# EAGLE design SmartLEDShield_Teensy4_V5 (EAGLE 9.6.1)
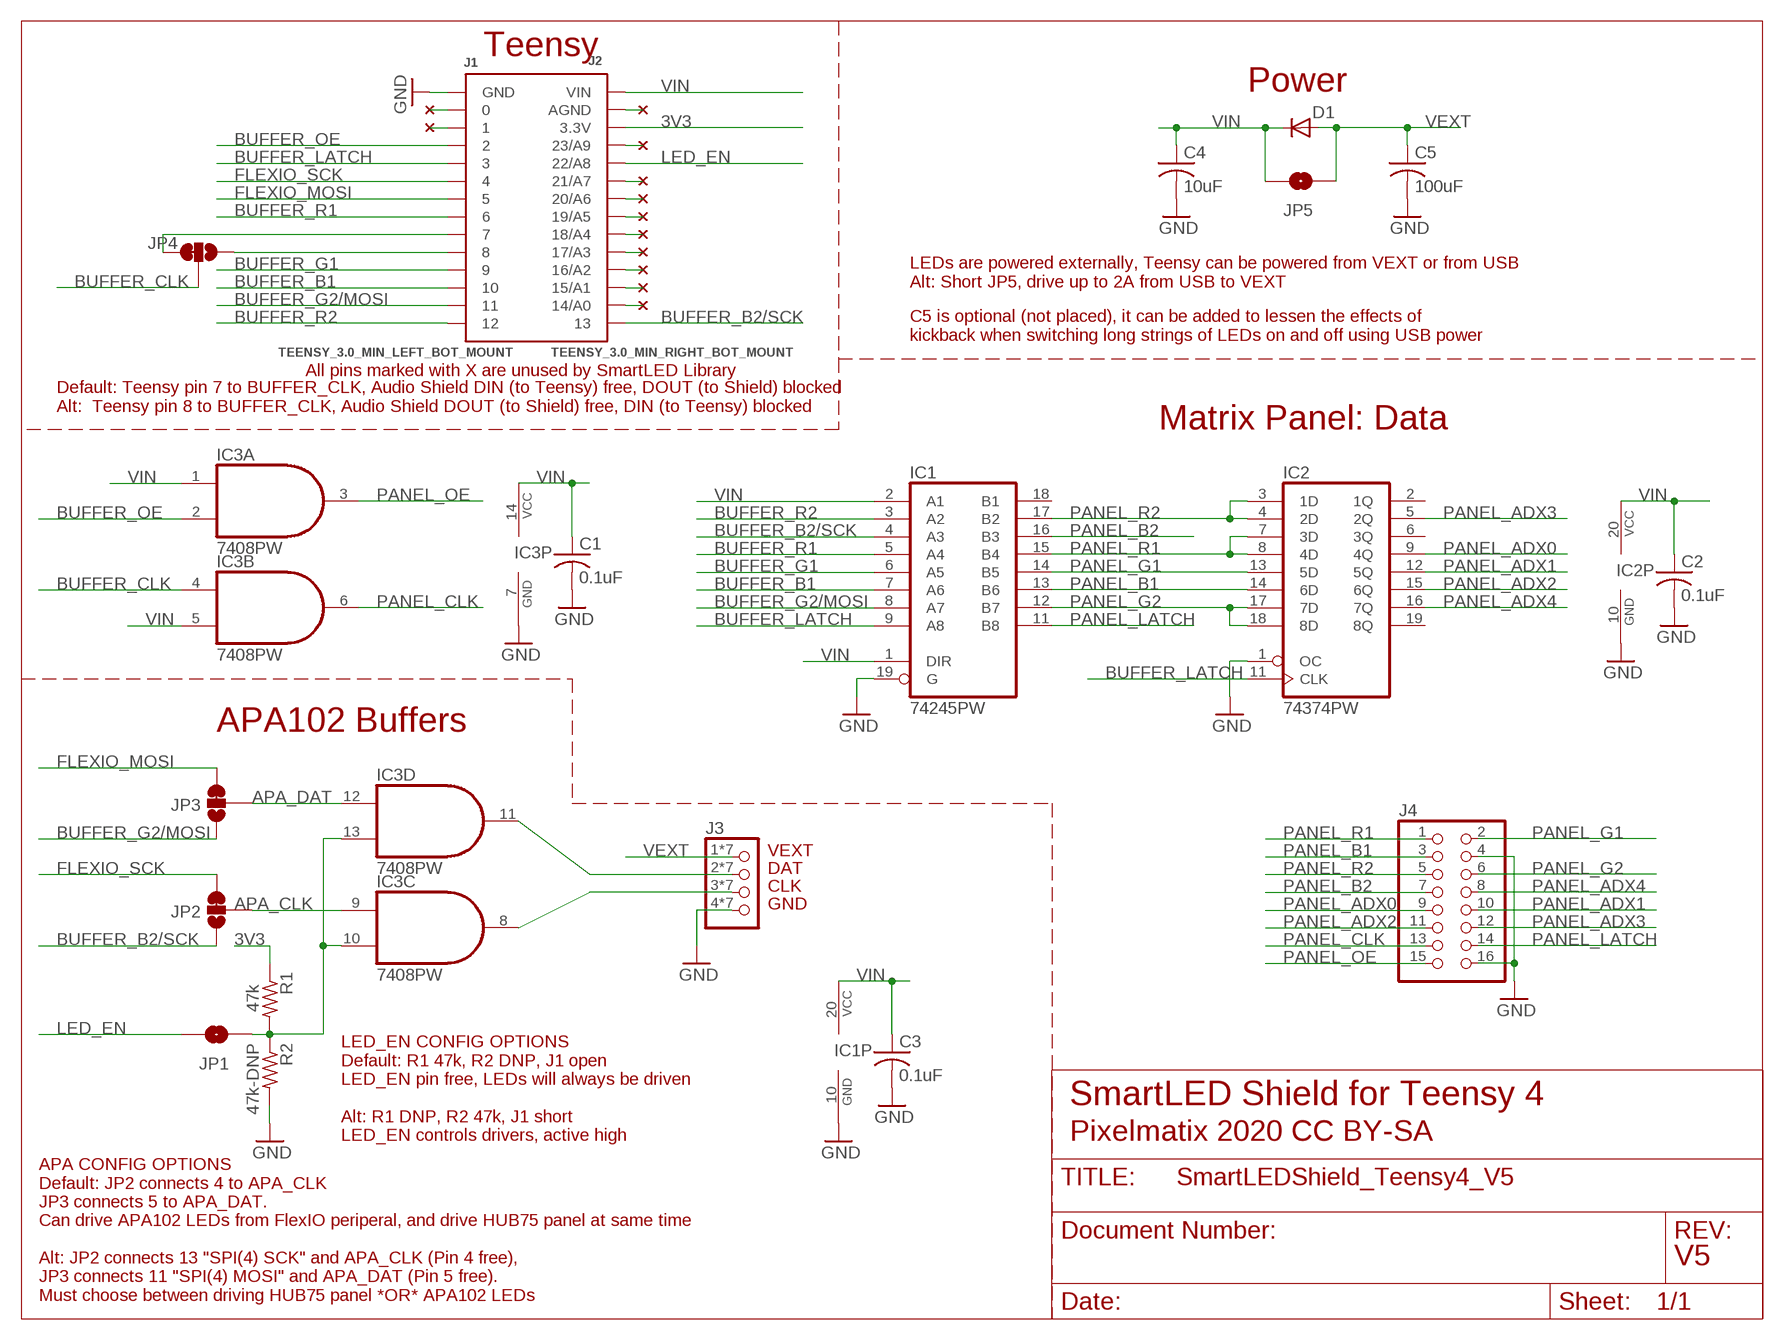
[diagram p0: schematic, sheet 1]

## Parts
C1  0.1uF  C-USC0603  [C0603]
C2  0.1uF  C-USC0603  [C0603]
C3  0.1uF  C-USC0603  [C0603]
C4  10uF  C-USC0805  [C0805]
C5  100uF  C-USC1206  [C1206]
D1  MBR0520LT  [SOD123]
IC1  74245PW  [TSSOP-20]
IC2  74374PW  [TSSOP-20]
IC3  7408PW  [TSSOP14]
J1  TEENSY_3.0_MIN_LEFT_BOT_MOUNT  [TEENSY_DUAL_HEADER_BOT_MOUNT_LEFT]
J2  TEENSY_3.0_MIN_RIGHT_BOT_MOUNT  [TEENSY_DUAL_HEADER_BOT_MOUNT_RIGHT]
J3  PINHD-1X04_WIREPADS_NARROW  [1X04SMDWIRES_NARROW]
J4  PINHD-2X08_SMARTMATRIX_SSMTHT  [SMARTMATRIX_SSMTHT]
JP1  JUMPER-SMT_2_NO_SILK  [SMT-JUMPER_2_NO_SILK]
JP2  JUMPER-SMT_3_1-NC_TRACE_SILK  [SMT-JUMPER_3_1-NC_TRACE_SILK]
JP3  JUMPER-SMT_3_1-NC_TRACE_SILK  [SMT-JUMPER_3_1-NC_TRACE_SILK]
JP4  JUMPER-SMT_3_1-NC_TRACE_NO-SILK  [SMT-JUMPER_3_1-NC_TRACE_NO-SILK]
JP5  JUMPER-SMT_2_NO_SILK  [SMT-JUMPER_2_NO_SILK]
R1  47k  R-US_R0603  [R0603]
R2  47k-DNP  R-US_R0603  [R0603]
U$1  NC  (no package)
U$2  NC  (no package)
U$3  NC  (no package)
U$4  NC  (no package)
U$6  NC  (no package)
U$7  NC  (no package)
U$8  NC  (no package)
U$9  NC  (no package)
U$11  NC  (no package)
U$13  NC  (no package)
U$14  NC  (no package)
U$15  NC  (no package)

## Nets
3V3 [power]: J2.3V3_A(3.3V) J2.3V3_B(3.3V) R1.1
APA_CLK: IC3.9(C:I0) JP2.2
APA_DAT: IC3.12(D:I0) JP3.2
BUFFER_B1: IC1.7(A6) J1.10A J1.10B
BUFFER_B2/SCK: IC1.4(A3) J2.13A J2.13B JP2.1
BUFFER_CLK: IC3.4(B:I0) JP4.2
BUFFER_G1: IC1.6(A5) J1.9A J1.9B
BUFFER_G2/MOSI: IC1.8(A7) J1.11A J1.11B JP3.1
BUFFER_LATCH: IC1.9(A8) IC2.11(CLK) J1.3A J1.3B
BUFFER_OE: IC3.2(A:I1) J1.2A J1.2B
BUFFER_R1: IC1.5(A4) J1.6A J1.6B
BUFFER_R2: IC1.3(A2) J1.12A J1.12B
CLK1: IC3.8(C:O) J3.3 J3.3-1 J3.3-2 J3.3-3 J3.3-4 J3.3-5 J3.3-6
DAT1: IC3.11(D:O) J3.2 J3.2-1 J3.2-2 J3.2-3 J3.2-4 J3.2-5 J3.2-6
FLEXIO_MOSI: J1.5A J1.5B JP3.3
FLEXIO_SCK: J1.4A J1.4B JP2.3
GND: C1.2 C2.2 C3.2 C4.2 C5.2 IC1.10(GND) IC1.19(G) IC2.1(OC) IC2.10(GND) IC3.7(P:GND) J1.GNDA(GND) J1.GNDB(GND) J3.4 J3.4-1 J3.4-2 J3.4-3 J3.4-4 J3.4-5 J3.4-6 J4.4 J4.16 R2.2
LED_EN: J2.22A(22/A8) J2.22B(22/A8) JP1.1
N$1: J1.0A J1.0B U$1.P$1
N$2: J2.21A(21/A7) J2.21B(21/A7) U$2.P$1
N$3: J2.20A(20/A6) J2.20B(20/A6) U$6.P$1
N$4: IC3.10(C:I1) IC3.13(D:I1) JP1.2 R1.2 R2.1
N$5: J1.1A J1.1B U$4.P$1
N$6: J2.AGND_A(AGND) J2.AGND_B(AGND) U$8.P$1
N$7: J2.19A(19/A5) J2.19B(19/A5) U$9.P$1
N$9: J2.18A(18/A4) J2.18B(18/A4) U$11.P$1
N$10: J2.23A(23/A9) J2.23B(23/A9) U$3.P$1
N$11: J2.16A(16/A2) J2.16B(16/A2) U$13.P$1
N$12: J2.15A(15/A1) J2.15B(15/A1) U$14.P$1
N$13: J2.17A(17/A3) J2.17B(17/A3) U$7.P$1
N$14: J2.14A(14/A0) J2.14B(14/A0) U$15.P$1
N$15: J1.7A J1.7B JP4.3
N$17: J1.8A J1.8B JP4.1
PANEL_ADX0: IC2.9(4Q) J4.9
PANEL_ADX1: IC2.12(5Q) J4.10
PANEL_ADX2: IC2.15(6Q) J4.11
PANEL_ADX3: IC2.5(2Q) J4.12
PANEL_ADX4: IC2.16(7Q) J4.8
PANEL_B1: IC1.13(B6) IC2.14(6D) J4.3
PANEL_B2: IC1.16(B3) J4.7
PANEL_CLK: IC3.6(B:O) J4.13
PANEL_G1: IC1.14(B5) IC2.13(5D) J4.2
PANEL_G2: IC1.12(B7) IC2.17(7D) IC2.18(8D) J4.6
PANEL_LATCH: IC1.11(B8) J4.14
PANEL_OE: IC3.3(A:O) J4.15
PANEL_R1: IC1.15(B4) IC2.7(3D) IC2.8(4D) J4.1
PANEL_R2: IC1.17(B2) IC2.3(1D) IC2.4(2D) J4.5
VEXT: C5.1 D1.A J3.1 J3.1-1 J3.1-2 J3.1-3 J3.1-4 J3.1-5 J3.1-6 JP5.2
VIN: C1.1 C2.1 C3.1 C4.1 D1.C IC1.1(DIR) IC1.2(A1) IC1.20(VCC) IC2.20(VCC) IC3.1(A:I0) IC3.5(B:I1) IC3.14(P:VCC) J2.VIN_A(VIN) J2.VIN_B(VIN) JP5.1
Unconnected: IC1.18(B1) IC2.2(1Q) IC2.6(3Q) IC2.19(8Q)

## Notes on the sheet
- Teensy
- Power
- LEDs are powered externally, Teensy can be powered from VEXT or from USB
  Alt: Short JP5, drive up to 2A from USB to VEXT
- C5 is optional (not placed), it can be added to lessen the effects of
  kickback when switching long strings of LEDs on and off using USB power
- All pins marked with X are unused by SmartLED Library
- Default: Teensy pin 7 to BUFFER_CLK, Audio Shield DIN (to Teensy) free, DOUT (to Shield) blocked
  Alt:  Teensy pin 8 to BUFFER_CLK, Audio Shield DOUT (to Shield) free, DIN (to Teensy) blocked
- Matrix Panel: Data
- APA102 Buffers
- VEXT
- DAT
- CLK
- GND
- SmartLED Shield for Teensy 4
- LED_EN CONFIG OPTIONS
  Default: R1 47k, R2 DNP, J1 open
  LED_EN pin free, LEDs will always be driven
  
  Alt: R1 DNP, R2 47k, J1 short
  LED_EN controls drivers, active high
- Pixelmatix 2020 CC BY-SA
- V5
- APA CONFIG OPTIONS
  Default: JP2 connects 4 to APA_CLK
  JP3 connects 5 to APA_DAT.
  Can drive APA102 LEDs from FlexIO periperal, and drive HUB75 panel at same time
  
  Alt: JP2 connects 13 "SPI(4) SCK" and APA_CLK (Pin 4 free),
  JP3 connects 11 "SPI(4) MOSI" and APA_DAT (Pin 5 free).
  Must choose between driving HUB75 panel *OR* APA102 LEDs

## Library data of the parts
C1-C5 = scanlime:C-US: CAPACITOR, American symbol; PARTNO: CAP CER 0.1UF 10V 10% X7R 0805
D1 = diode:MBR0520LT: SCHOTTKY BARRIER RECTIFIER Source: http://onsemi.com .. MBR0520LT1-D.pdf
IC1 = eclibrary:74*245: Octal BUS TRANSCEIVER, 3-state
IC2 = eclibrary:74*374: Octal D type transparent LATCH, edge triggered
IC3 = eclibrary:74*08: Quad 2-input AND gate
J1 = eclibrary:TEENSY_3.0_MIN_LEFT
J2 = eclibrary:TEENSY_3.0_MIN_RIGHT
J3 = eclibrary:PINHD-1X04: PIN HEADER
J4 = eclibrary:PINHD-2X08: PIN HEADER
JP1 JP5 = SparkFun-Jumpers:JUMPER-SMT_2_NO: Normally open jumper This jumper has two pads in close proximity to each other. Apply solder to close the connection. Round pads are easier to solder for beginners, but are a lot larger. SparkFun Product that uses the round pads: SparkFun EL Sequencer <https://www.sparkfun.com/products/12781>
JP2-JP4 = SparkFun-Jumpers:JUMPER-SMT_3_1-NC_TRACE: Normally closed trace jumper (1 of 2 connections) This jumper has a trace between two pads so it's normally closed (NC). The other connection is normally open (NO). Use a razor knife to open the connection. For best results follow the IPC guidelines for cutting traces: Cutout at least 0.063 mm (0.005 in). Remove all loose material to clean up the cut area. Seal the cut with an approved epoxy. Reapply solder to reclose the connection, or to close the NO connection.
R1 R2 = rcl:R-US_: RESISTOR, American symbol
U$1-U$4 U$6-U$9 U$11 U$13-U$15 = eclibrary:NC

## Net classes
0 default: width 0.254 mm
1 power: width 0.406 mm

## Board
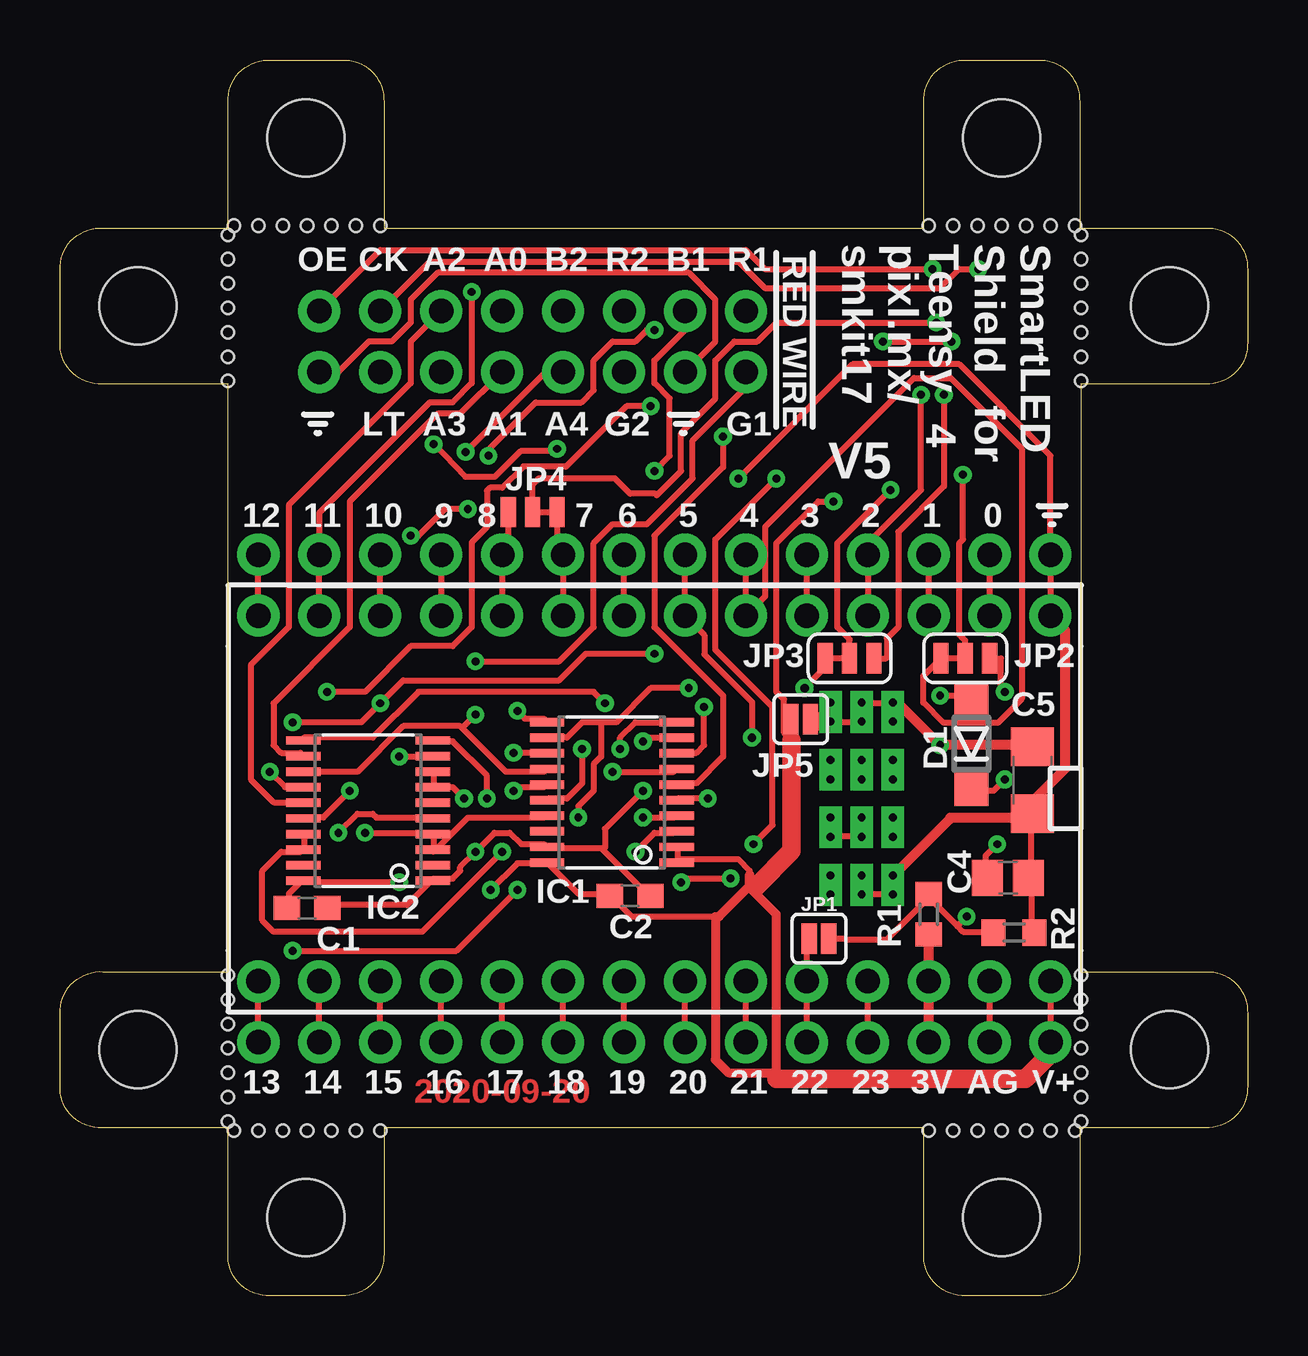
[diagram p1: board, top side]
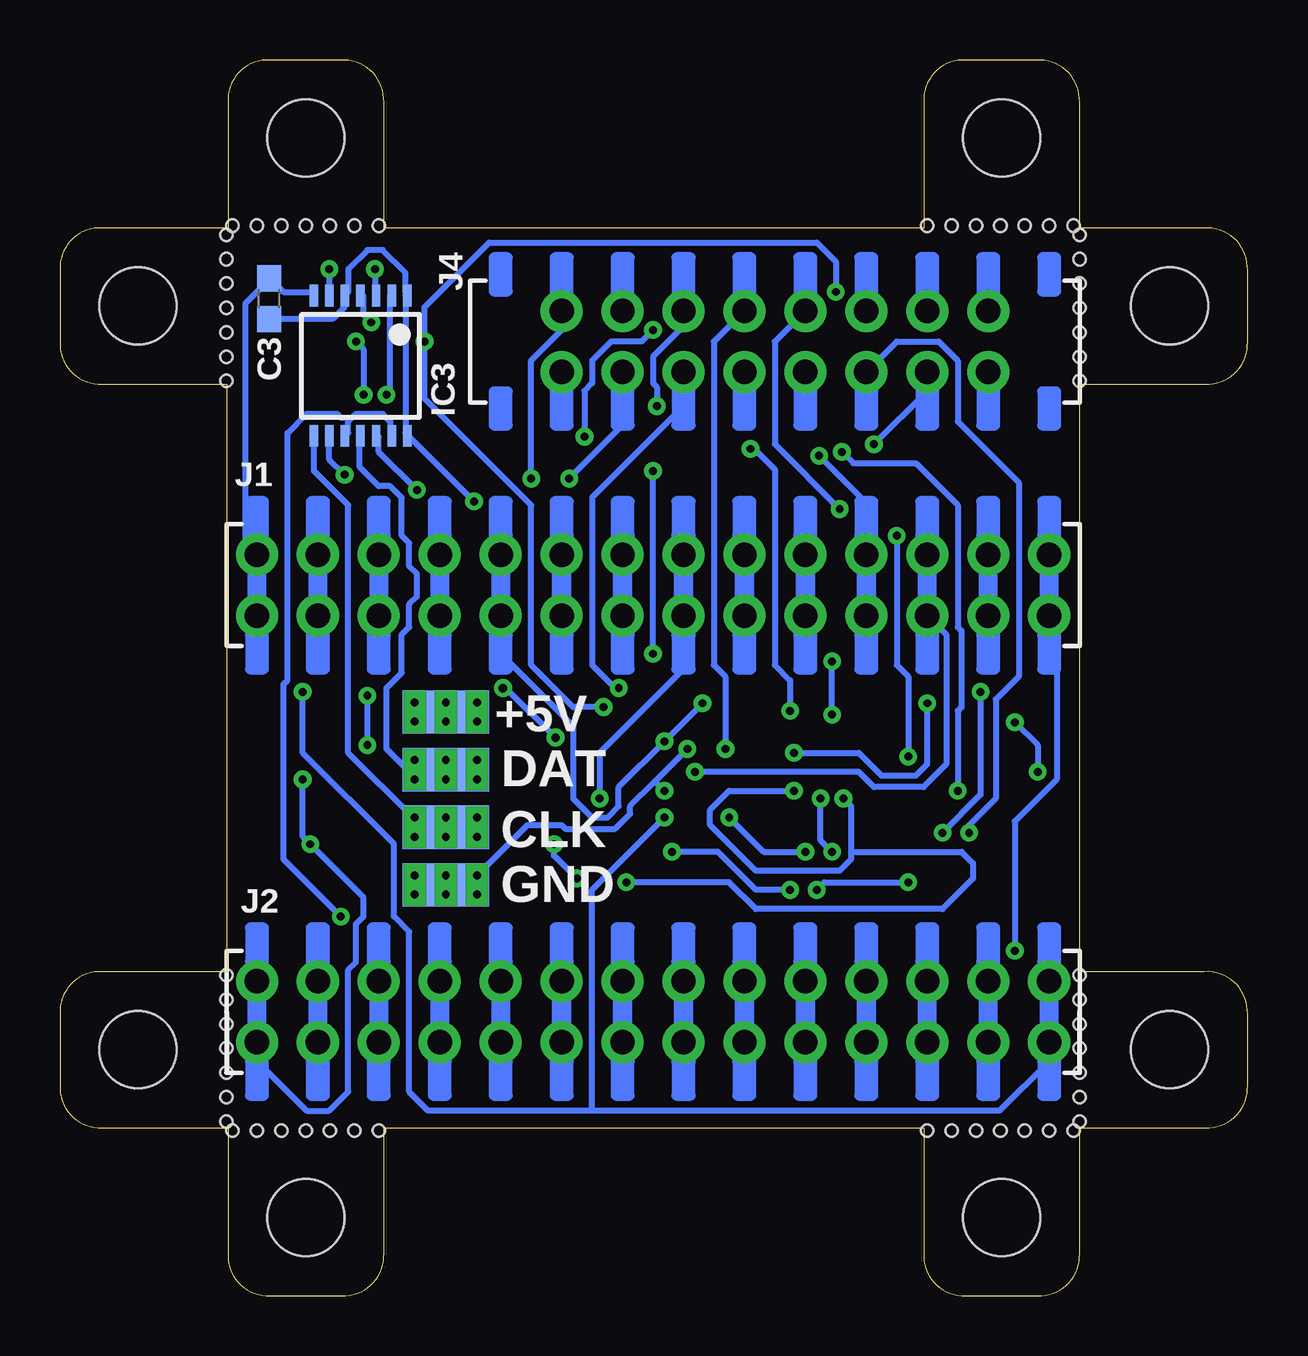
[diagram p2: board, bottom side, seen from below]

Size 49.5 x 51.5 mm. Coordinates in mm from the lower left corner, seen from the top.
Outline: 13.5,44.5 36,44.5 36,49.75 arc-95 37.8,51.5 40.75,51.5 arc-95 42.5,49.75 42.5,44.5 47.75,44.5 arc-95 49.5,42.75 49.5,39.75 arc-95 47.75,38 42.56,38 42.56,13.5 47.75,13.5 arc-95 49.5,11.75 49.5,8.75 arc-95 47.75,7 42.5,7 42.5,1.75 arc-95 40.75,0 37.75,0 arc-95 36,1.75 36,7 13.5,7 13.5,1.75 arc-95 11.75,0 8.75,0 arc-95 7,1.75 7,7 1.75,7 arc-95 0,8.75 0,11.75 arc-95 1.8,13.5 7,13.5 7,38 1.75,38 arc-95 0,39.75 0,42.75 arc-95 1.8,44.5 7,44.5 7,49.75 arc-95 8.8,51.5 11.75,51.5 arc-95 13.5,49.75 13.5,44.5
Copper layers (1*16): Top 0.0356mm / dielectric 1.5011mm / Bottom 0.0356mm
Design rules "OshParkMod-8mil-20150316": minimum track width 6mil, minimum drill 13mil, track to track 8mil, track to pad 8mil, pad to pad 8mil, via to via 8mil, smd to smd 8mil, copper to edge 15mil, drill to drill 6mil, minimum pad ring 12mil, minimum via ring 8mil, stop-mask expansion 3mil, vias tented up to drill 25mil, thermal gap 10mil
Holes 0.51 mm at 42.56,44.22 42.56,43.2 42.56,42.18 42.56,41.17 42.56,40.15 42.56,39.13 42.56,38.12 36.21,44.6 37.23,44.6 38.24,44.6 39.26,44.6 40.27,44.6 41.29,44.6 42.31,44.6 7.25,44.6 8.27,44.6 9.29,44.6 10.3,44.6 11.32,44.6 12.33,44.6 13.35,44.6 7,38.12 7,39.13 7,40.15 7,41.17 7,42.18 7,43.2 7,44.22 7,7.26 7,8.27 7,9.29 7,10.31 7,11.32 7,12.34 7,13.35 13.35,6.88 12.33,6.88 11.32,6.88 10.3,6.88 9.29,6.88 8.27,6.88 7.25,6.88 42.31,6.88 41.29,6.88 40.27,6.88 39.26,6.88 38.24,6.88 37.23,6.88 36.21,6.88 42.56,13.35 42.56,12.34 42.56,11.32 42.56,10.31 42.56,9.29 42.56,8.27 42.56,7.26

### Footprints (pad centres in the part's own frame; a part is rotated, then mirrored left to right if it is on the bottom)
C0603 = smd 1.1 x 1: 1 -0.85,0; 2 0.85,0
C0805 = smd 1.3 x 1.5: 1 -0.85,0; 2 0.85,0
C1206 = smd 1.6 x 1.8: 1 -1.4,0; 2 1.4,0
SOD123 = smd 1.4 x 1.4: A 1.9,0; C -1.9,0
STAND-OFF-3MM = hole 3.2: 0,0
TSSOP-20 = smd 0.35 x 1.43: 1 -2.925,-2.7; 2 -2.275,-2.7; 3 -1.625,-2.7; 4 -0.975,-2.7; 5 -0.325,-2.7; 6 0.325,-2.7; 7 0.975,-2.7; 8 1.625,-2.7; 9 2.275,-2.7; 10 2.925,-2.7; 11 2.925,2.7; 12 2.275,2.7; 13 1.625,2.7; 14 0.975,2.7; 15 0.325,2.7; 16 -0.325,2.7; 17 -0.975,2.7; 18 -1.625,2.7; 19 -2.275,2.7; 20 -2.925,2.7
TSSOP14 = smd 0.35 x 0.9: 1 -1.95,-2.925; 2 -1.3,-2.925; 3 -0.65,-2.925; 4 0,-2.925; 5 0.65,-2.925; 6 1.3,-2.925; 7 1.95,-2.925; 8 1.95,2.925; 9 1.3,2.925; 10 0.65,2.925; 11 0,2.925; 12 -0.65,2.925; 13 -1.3,2.925; 14 -1.95,2.925
TEENSY_DUAL_HEADER_BOT_MOUNT_LEFT = drill 1.016 pad 1.753: 0A 1.27,13.97; 0B -1.27,13.97; 1A 1.27,11.43; 1B -1.27,11.43; 2A 1.27,8.89; 2B -1.27,8.89; 3A 1.27,6.35; 3B -1.27,6.35; 4A 1.27,3.81; 4B -1.27,3.81; 5A 1.27,1.27; 5B -1.27,1.27; 6A 1.27,-1.27; 6B -1.27,-1.27; 7A 1.27,-3.81; 7B -1.27,-3.81; 8A 1.27,-6.35; 8B -1.27,-6.35; 9A 1.27,-8.89; 9B -1.27,-8.89; 10A 1.27,-11.43; 10B -1.27,-11.43; 11A 1.27,-13.97; 11B -1.27,-13.97; 12A 1.27,-16.51; 12B -1.27,-16.51; GNDA 1.27,16.51; GNDB -1.27,16.51
TEENSY_DUAL_HEADER_BOT_MOUNT_RIGHT = drill 1.016 pad 1.753: 3V3_A -1.27,11.43; 3V3_B 1.27,11.43; 13A -1.27,-16.51; 13B 1.27,-16.51; 14A -1.27,-13.97; 14B 1.27,-13.97; 15A -1.27,-11.43; 15B 1.27,-11.43; 16A -1.27,-8.89; 16B 1.27,-8.89; 17A -1.27,-6.35; 17B 1.27,-6.35; 18A -1.27,-3.81; 18B 1.27,-3.81; 19A -1.27,-1.27; 19B 1.27,-1.27; 20A -1.27,1.27; 20B 1.27,1.27; 21A -1.27,3.81; 21B 1.27,3.81; 22A -1.27,6.35; 22B 1.27,6.35; 23A -1.27,8.89; 23B 1.27,8.89; AGND_A -1.27,13.97; AGND_B 1.27,13.97; VIN_A -1.27,16.51; VIN_B 1.27,16.51
1X04SMDWIRES_NARROW = smd 1.8 x 3.6: 1 -3.6,0; 2 -1.2,0; 3 1.2,0; 4 3.6,0 | drill 0.33 pad 0.508 square: 1-1 -4,1.3; 1-2 -3.2,1.3; 1-3 -4,0; 1-4 -3.2,0; 1-5 -4,-1.3; 1-6 -3.2,-1.3; 2-1 -1.6,1.3; 2-2 -0.8,1.3; 2-3 -1.6,0; 2-4 -0.8,0; 2-5 -1.6,-1.3; 2-6 -0.8,-1.3; 3-1 0.8,1.3; 3-2 1.6,1.3; 3-3 0.8,0; 3-4 1.6,0; 3-5 0.8,-1.3; 3-6 1.6,-1.3; 4-1 3.2,1.3; 4-2 4,1.3; 4-3 3.2,0; 4-4 4,0; 4-5 3.2,-1.3; 4-6 4,-1.3
SMARTMATRIX_SSMTHT = drill 1.016 pad 1.753: 1 1.27,8.89; 2 -1.27,8.89; 3 1.27,6.35; 4 -1.27,6.35; 5 1.27,3.81; 6 -1.27,3.81; 7 1.27,1.27; 8 -1.27,1.27; 9 1.27,-1.27; 10 -1.27,-1.27; 11 1.27,-3.81; 12 -1.27,-3.81; 13 1.27,-6.35; 14 -1.27,-6.35; 15 1.27,-8.89; 16 -1.27,-8.89
SMT-JUMPER_2_NO_SILK = smd 0.635 x 1.27: 1 -0.406,0; 2 0.406,0
SMT-JUMPER_3_1-NC_TRACE_SILK = smd 0.635 x 1.27: 1 -1.016,0; 2 0,0; 3 1.016,0
SMT-JUMPER_3_1-NC_TRACE_NO-SILK = smd 0.635 x 1.27: 1 -1.016,0; 2 0,0; 3 1.016,0
R0603 = smd 1 x 1.1: 1 -0.85,0; 2 0.85,0

### Placement (x,y rotation side)
C1  10.3,16.15 0 top
C2  23.76,16.66 0 top
C3  40.78,41.55 90 bottom
C4  39.51,17.42 0 top
C5  40.53,21.48 270 top
D1  37.99,23.01 90 top
H1  STAND-OFFSTAND-OFF-3MM  [STAND-OFF-3MM]  46.25,41.25 90 top
H2  STAND-OFFSTAND-OFF-3MM  [STAND-OFF-3MM]  39.25,48.25 90 top
H3  STAND-OFFSTAND-OFF-3MM  [STAND-OFF-3MM]  10.25,48.25 90 top
H4  STAND-OFFSTAND-OFF-3MM  [STAND-OFF-3MM]  3.25,41.25 180 top
H5  STAND-OFFSTAND-OFF-3MM  [STAND-OFF-3MM]  3.25,10.25 180 top
H6  STAND-OFFSTAND-OFF-3MM  [STAND-OFF-3MM]  10.25,3.25 270 top
H7  STAND-OFFSTAND-OFF-3MM  [STAND-OFF-3MM]  39.25,3.25 270 top
H9  STAND-OFFSTAND-OFF-3MM  [STAND-OFF-3MM]  46.25,10.25 0 top
IC1  23,20.97 90 top
IC2  12.84,20.21 90 top
IC3  36.97,38.75 180 bottom
J1  24.78,29.61 90 bottom
J2  24.78,11.83 90 bottom
J3  33.42,20.72 270 bottom
J4  19.7,39.77 90 bottom
JP1  31.64,14.88 0 top
JP2  37.73,26.56 180 top
JP3  32.91,26.56 180 top
JP4  19.7,32.66 0 top
JP5  30.88,24.02 0 top
R1  36.21,15.89 90 top
R2  39.77,15.13 0 top

### Tracks (layer width: path | path; a pad name or v marks a point on that pad's centre or on a via)
3V3
  Top 0.406: R1.1 J2.3V3_B J2.3V3_A
APA_CLK  (via drill 0.33)
  Top 0.254: JP2.2 37.73,27.32 37.64,27.39 37.48,27.55 37.48,31.36 37.64,31.52 v37.64,34.21
  Bottom 0.254: v37.64,34.21 38.27,34.85 38.27,35.8 IC3.9
APA_DAT  (via drill 0.33)
  Top 0.254: JP3.2 32.91,27.32 32.88,27.39 32.4,27.86 32.4,31.36 v34.62,33.58
  Bottom 0.254: v34.62,33.58 36.21,35.17 36.21,35.8 IC3.12
BUFFER_B1  (via drill 0.33)
  Top 0.254: v23.03,21.83 25.57,21.83 IC1.7 | J1.10B J1.10A
  Bottom 0.254: v23.03,21.83 16.21,21.83 15.57,21.2 13.51,21.2 12.56,22.15 12.56,27.55 J1.10B
BUFFER_B2/SCK  (via drill 0.33)
  Top 0.254: JP2.1 39.23,26.56 39.23,25.32 v39.38,25.16 | v24.3,19.93 25.57,19.93 IC1.4 | J2.13A J2.13B
  Bottom 0.254: 27.32,7.7 10.33,7.7 8.27,9.77 J2.13A | 27.32,7.7 34.15,7.7 34.94,8.5 34.94,15.16 35.58,15.8 35.58,18.81 39.38,22.62 v39.38,25.16 | v24.3,19.93 27.32,16.91 27.32,7.7
BUFFER_CLK  (via drill 0.33)
  Top 0.254: v36.53,40.56 29.86,40.56 29.07,39.77 28.11,39.77 27.32,38.98 27.32,37.39 25.89,35.96 25.89,34.37 24.88,33.36 24.81,33.42 23.76,33.42 23.13,34.05 19.95,34.05 19.7,33.8 JP4.2
  Bottom 0.254: v36.53,40.56 36.84,40.88 36.84,41.67 IC3.4
BUFFER_G1  (via drill 0.33)
  Top 0.254: v27.64,35.8 27.64,34.53 24.78,31.67 24.78,27.86 27.64,25.01 27.64,22.47 26.53,21.36 25.73,21.36 IC1.6 | v24.78,40.25 24.46,40.25 23.99,39.77 23.03,39.77 22.24,38.98 22.24,37.74 21.73,37.23 19.83,37.23 17.86,35.26 v17.86,35.01 | J1.9A J1.9B
  Bottom 0.254: v27.64,35.8 27.64,37.71 27.32,38.02 27.32,38.98 26.53,39.77 25.26,39.77 v24.78,40.25 | v17.86,35.01 15.89,33.04 J1.9A
BUFFER_G2/MOSI  (via drill 0.33)
  Top 0.254: JP3.1 34.43,26.56 34.46,26.59 34.46,27.39 34.94,27.86 34.94,31.83 36.84,33.74 v36.84,37.55 | J1.11B J1.11A 10.81,32.63 15.41,37.23 16.37,37.23 17.16,38.02 v17.16,41.83 | v34.3,39.77 v37.16,39.77 | v26.84,24.53 26.84,22.94 26.53,22.62 25.73,22.62 IC1.8
  Bottom 0.254: v36.84,37.55 36.84,39.45 v37.16,39.77 | v26.84,24.53 28.11,24.53 29.86,26.28 29.86,32.94 34.3,37.39 v34.3,39.77 34.3,41.2 31.61,43.9 17.95,43.9 17.16,43.1 v17.16,41.83
BUFFER_LATCH  (via drill 0.33)
  Top 0.254: v22.72,24.69 22.24,25.16 14.94,25.16 13.03,23.26 10.18,23.26 IC2.11 | v24.3,23.1 24.46,23.26 25.57,23.26 IC1.9 | J1.3B J1.3A
  Bottom 0.254: v22.72,24.69 v24.3,23.1 26.21,21.2 26.21,20.4 26.68,19.93 27.32,19.93 28.11,20.72 28.11,23.74 31.13,26.75 J1.3B
BUFFER_OE  (via drill 0.33)
  Top 0.254: v35.89,37.55 35.89,33.58 33.67,31.36 J1.2A J1.2B
  Bottom 0.254: v35.89,37.55 35.73,37.71 35.73,41.67 IC3.2
BUFFER_R1  (via drill 0.33)
  Top 0.254: v27,20.72 25.73,20.72 IC1.5 | J1.6B J1.6A
  Bottom 0.254: v27,20.72 27,22.62 23.51,26.12 J1.6B
BUFFER_R2  (via drill 0.33)
  Top 0.254: v23.99,18.5 24.78,19.29 25.57,19.29 IC1.3 | v19.06,16.91 16.52,14.37 v9.7,14.37 | J1.12B J1.12A
  Bottom 0.254: v23.99,18.5 22.08,18.5 20.49,16.91 v19.06,16.91 | v9.7,14.37 9.7,19.77 7.95,21.51 7.95,28.02 J1.12B
CLK1
  Top 0.254: J3.3-6 34.78,19.13 34.78,19.77 J3.3-5 | 32.24,19.13 32.24,19.77 J3.3-1 | 32.24,19.13 33.35,19.13 J3.3-4 | 32.24,19.13 J3.3-2
  Bottom 0.254: IC3.8 38.91,35.8 38.91,34.37 37.48,32.94 37.48,22.62 34.78,19.93 | J3.3-4 33.51,19.13 33.51,19.45 J3.3 | J3.3-3 33.51,19.77 33.51,19.61 J3.3 | 34.78,19.93 J3.3 | 34.78,19.93 J3.3-5
DAT1
  Bottom 0.254: 34.78,21.99 34.78,21.67 J3.2-6 | 33.51,21.99 34.78,21.99 | 34.78,21.99 35.1,21.99 35.89,22.78 35.89,25.32 35.26,25.96 35.26,27.55 34.94,27.86 34.94,28.82 34.62,29.13 34.62,30.09 34.94,30.4 34.94,31.36 35.26,31.67 35.26,33.26 35.73,33.74 36.21,33.74 37,34.53 37,35.8 IC3.11 | 32.24,21.83 32.24,21.67 J3.2-2 32.24,21.83 | 32.24,21.83 32.4,21.99 33.35,21.99 J3.2 | J3.2-4 33.51,21.67 33.51,21.83 J3.2 | 32.24,21.83 32.08,21.99 32.24,22.15 32.24,22.31 J3.2-1 | 33.51,21.99 33.51,22.31 J3.2-3 | 33.51,21.99 J3.2 | 34.78,21.99 J3.2-5 | 34.78,21.99 J3.2
FLEXIO_MOSI  (via drill 0.35)
  Top 0.254: v28.84,23.26 28.84,24.74 26.86,26.72 26.86,27.53 J1.5B J1.5A | v31.04,25.32 31.89,26.18 JP3.3
  Bottom 0.254: v28.84,23.26 30.88,25.29 31.13,25.29 31.1,25.32 v31.04,25.32
FLEXIO_SCK
  Top 0.254: J1.4A J1.4B 29.4,29.15 29.4,32.05 35.6,38.25 37.13,38.25 40.08,35.3 40.08,24.88 39.08,23.88 36.83,23.88 35.99,24.72 35.99,25.83 JP2.3
GND  (via drill 0.33)
  Top 0.254: 22.64,18.58 22.56,18.66 20.34,18.66 IC1.19 20.18,18.81 19.22,18.81 18.75,19.29 18.11,19.29 v17.32,18.5 16.68,17.86 16.68,17.7 16.37,17.39 15.57,17.39 IC2.1 15.41,17.23 14.46,16.27 11.29,16.27 C1.2 | 22.64,18.58 24.46,16.75 C2.2 | v17.8,20.72 17.8,21.67 16.37,23.1 15.57,23.1 IC2.10 | J3.4-2 32.24,16.75 32.24,17.39 J3.4-1 | v23.35,22.78 23.35,23.26 23.99,23.89 25.57,23.89 IC1.10 | J3.4-4 33.51,16.75 34.62,16.75 J3.4-6 34.78,16.75 34.78,17.39 J3.4-5 34.78,17.55 | J4.16 11.6,38.5 12.87,39.77 13.83,39.77 14.62,40.56 14.62,41.52 15.73,42.63 26.21,42.63 27.32,41.52 27.32,39.77 J4.4 | J1.GNDB J1.GNDA 41.29,35.01 37.48,38.82 33.03,38.82 v28.27,34.05 | v24.3,21.04 22.72,19.45 22.72,18.66 22.64,18.58 | R2.2 40.5,15.16 40.5,17.39 C4.2 40.5,17.55 40.5,19.93 C5.2 40.66,20.09 40.66,20.72
  Top 0.406: 34.78,17.55 37.1,19.86 37.1,19.93 40.5,19.93 | 40.66,20.72 41.89,21.96 41.89,27.74 J1.GNDB
  Bottom 0.254: v17.8,20.72 17.8,18.97 v17.32,18.5 | 24.7,21.43 25.73,20.4 25.73,20.09 26.37,19.45 28.43,19.45 28.59,19.61 30.02,19.61 32.08,17.55 J3.4 | 24.7,21.43 v23.35,22.78 | J3.4-4 33.51,16.75 33.51,17.07 J3.4 | J3.4-3 33.51,17.39 33.51,17.23 J3.4 | J3.4-1 32.24,17.55 J3.4 | IC3.7 39.07,41.83 40.18,41.83 40.66,42.31 C3.2 40.81,42.31 41.77,41.36 41.77,31.36 J1.GNDA | J4.4 26.05,36.28 v28.27,34.05 | 24.7,21.43 v24.3,21.04
LED_EN
  Top 0.254: J2.22A J2.22B 31.13,14.78 JP1.1
N$1
  Top 0.254: J1.0B J1.0A
N$2
  Top 0.254: J2.21A J2.21B
N$3
  Top 0.254: J2.20A J2.20B
N$4  (via drill 0.33)
  Top 0.254: 36.21,16.59 34.46,14.85 32.72,14.85 32.69,14.88 JP1.2 | 36.21,16.59 37.4,15.4 | 37.4,15.4 37.64,15.16 38.91,15.16 R2.1 | 36.21,16.59 R1.2 | 37.4,15.4 v37.8,15.8
  Bottom 0.254: 37.4,36.52 37.48,36.44 37.48,35.96 IC3.10 | 37.4,36.52 37.16,36.75 36.05,36.75 35.73,36.44 35.73,35.96 IC3.13 | v37.8,15.8 40.18,18.18 40.18,25.48 40.02,25.64 40.02,35.96 39.23,36.75 37.96,36.75 37.8,36.59 37.48,36.59 37.4,36.52
N$5
  Top 0.254: J1.1B J1.1A
N$6
  Top 0.254: J2.AGND_A J2.AGND_B
N$7
  Top 0.254: J2.19A J2.19B
N$9
  Top 0.254: J2.18A J2.18B
N$10
  Top 0.254: J2.23A J2.23B
N$11
  Top 0.254: J2.16A J2.16B
N$12
  Top 0.254: J2.15A J2.15B
N$13
  Top 0.254: J2.17A J2.17B
N$14
  Top 0.254: J2.14A J2.14B
N$15
  Top 0.254: JP4.3 20.72,31.13 J1.7A J1.7B
N$17
  Top 0.254: JP4.1 18.68,31.13 J1.8A J1.8B
PANEL_ADX0  (via drill 0.33)
  Top 0.254: v14.14,22.47 15.41,22.47 IC2.9 | v14.62,31.67 14.94,31.67 16.05,32.78 v17,32.78
  Bottom 0.254: v14.14,22.47 14.14,25.8 14.62,26.28 v14.62,31.67 | v17,32.78 19.7,35.48 19.7,39.77 J4.9
PANEL_ADX1
  Top 0.254: J4.10 16.68,36.75 15.73,36.75 12.08,33.1 12.08,27.86 8.9,24.69 8.9,22.94 9.22,22.62 10.02,22.62 IC2.12
PANEL_ADX2
  Top 0.254: J4.11 14.62,39.77 14.62,38.02 9.54,32.94 9.54,27.86 7.95,26.28 7.95,21.51 8.9,20.56 10.02,20.56 IC2.15
PANEL_ADX3  (via drill 0.33)
  Top 0.254: v11.6,19.29 12.4,20.09 13.03,20.09 13.19,19.93 15.41,19.93 IC2.5
  Bottom 0.254: v11.6,19.29 11.6,19.61 10.49,20.72 10.49,24.85 9.54,25.8 9.54,33.9 12.08,36.44 12.08,38.98 12.87,39.77 14.62,39.77 J4.12
PANEL_ADX4  (via drill 0.33)
  Top 0.254: v12.08,21.04 10.97,19.93 10.18,19.93 IC2.16 | v16.91,35.17 20.24,38.5 J4.8
  Bottom 0.254: v12.08,21.04 12.08,24.37 11.92,24.53 11.92,27.7 12.08,27.86 12.08,32.94 13.83,34.69 16.43,34.69 v16.91,35.17
PANEL_B1  (via drill 0.33)
  Top 0.254: v8.75,21.83 9.38,21.2 10.02,21.2 IC2.14 | v9.7,23.89 12.56,23.89 v13.35,24.69 14.3,25.64 20.81,25.64 21.92,26.75 v24.78,26.75 | v18.91,22.62 20.18,22.62 IC1.13 | J4.3 26.05,40.25 24.78,38.98 24.78,38.02 25.41,37.39 25.41,35.01 v24.78,34.37
  Bottom 0.254: v8.75,21.83 8.75,22.94 v9.7,23.89 | v13.35,24.69 13.35,22.15 13.83,21.67 15.26,21.67 16.21,22.62 v18.91,22.62 | v24.78,26.75 v24.78,34.37
PANEL_B2  (via drill 0.33)
  Top 0.254: v21.76,22.78 21.76,21.36 21.13,20.72 20.34,20.72 IC1.16
  Bottom 0.254: v21.76,22.78 21.76,25.8 22.24,26.28 22.24,39.77 J4.7
PANEL_CLK  (via drill 0.33)
  Top 0.254: v38.27,42.79 37.48,42.79 36.69,41.99 29.38,41.99 28.27,43.1 15.41,43.1 J4.13
  Bottom 0.254: v38.27,42.79 38.27,41.83 IC3.6
PANEL_G1  (via drill 0.33)
  Top 0.254: 16.76,23.66 18.59,21.83 20.18,21.83 IC1.14 | 16.76,23.66 16.68,23.74 14.3,23.74 12.4,21.83 10.18,21.83 IC2.13 | J4.2 28.59,37.86 26.37,35.64 26.37,34.05 24.46,32.15 23.03,32.15 22.24,31.36 22.24,27.86 20.81,26.43 v17.32,26.43 | 16.76,23.66 v17.32,24.21
  Bottom 0.254: v17.32,24.21 v17.32,26.43
PANEL_G2  (via drill 0.33)
  Top 0.254: IC2.17 10.18,19.13 10.18,18.66 IC2.18 10.02,18.5 9.22,18.5 8.43,17.7 8.43,15.64 8.9,15.16 15.1,15.16 v18.43,18.5 | 22.56,23.89 23.19,23.89 24.62,25.32 v26.21,25.32 | 22.56,23.89 21.76,23.89 21.13,23.26 20.34,23.26 IC1.12 | v21.61,19.93 21.61,20.4 22.24,21.04 22.24,22.15 22.56,22.47 22.56,23.89
  Bottom 0.254: v26.21,25.32 26.37,25.32 27.32,26.28 27.32,33.26 23.51,37.07 J4.6 | v18.43,18.5 20.18,18.5 v21.61,19.93
PANEL_LATCH  (via drill 0.33)
  Top 0.254: v19.06,24.37 19.38,24.05 20.18,24.05 IC1.11 | v20.72,35.29 20.62,35.2 19.19,35.2 18.13,34.13 16.91,34.13 15.6,35.48 v15.57,35.48
  Bottom 0.254: v19.06,24.37 19.06,25.64 19.7,26.28 19.7,34.44 20.56,35.29 v20.72,35.29 | v15.57,35.48 13.35,37.71 J4.14
PANEL_OE  (via drill 0.33)
  Top 0.254: v36.37,42.79 29.38,42.79 28.59,43.58 13.35,43.58 J4.15
  Bottom 0.254: v36.37,42.79 36.37,41.83 IC3.3
PANEL_R1  (via drill 0.33)
  Top 0.254: 15.57,21.2 15.57,21.83 IC2.8 | v18.91,21.04 19.06,21.2 20.18,21.2 IC1.15 | v16.84,20.72 16.37,21.2 15.57,21.2 | 15.57,21.2 IC2.7 | v29.86,34.05 27.32,31.52 27.32,26.91 29.7,24.53 29.7,19.61 v28.91,18.81 | v27.95,17.39 26.05,17.39 v25.89,17.23
  Bottom 0.254: v18.91,21.04 21.61,21.04 22.4,20.24 22.4,19.61 20.49,17.7 17,17.7 16.52,18.18 16.52,18.5 | 16.52,18.5 16.52,20.4 v16.84,20.72 | J4.1 28.59,40.25 29.86,38.98 v29.86,34.05 | v28.91,18.81 28.91,18.34 v27.95,17.39 | v25.89,17.23 21.61,17.23 20.49,16.12 12.71,16.12 11.45,17.39 11.45,18.02 11.92,18.5 16.52,18.5
PANEL_R2  (via drill 0.33)
  Top 0.254: IC1.17 20.18,19.93 17,19.93 15.57,18.5 IC2.3 15.57,18.66 15.57,19.13 IC2.4 15.41,19.29 v12.71,19.29 | v11.13,25.16 12.71,25.16 14.62,27.07 16.37,27.07 17.16,27.86 17.16,31.39 17.8,32.02 17.8,33.55 17.92,33.67 18.43,33.67 19.32,34.56 21.09,34.55 23.61,37.07 v24.62,37.07
  Bottom 0.254: v12.71,19.29 11.13,20.88 v11.13,25.16 | v24.62,37.07 24.62,37.86 24.78,38.02 24.78,39.13 23.51,40.41 J4.5
VEXT  (via drill 0.33)
  Top 0.254: J3.1-1 32.24,24.69 32.24,24.05 J3.1-2 32.24,23.89 33.35,23.89 J3.1-4 | 34.78,24.85 J3.1-5 | J3.1-6 34.78,24.05 35.1,24.37 J3.1-5 | J3.1-3 33.51,24.69 34.62,24.69 J3.1-5 | v36.69,25.01 37.96,25.01 D1.A | 40.5,22.94 C5.1
  Top 0.381: 31.38,23.92 JP5.2
  Top 0.406: 34.78,24.85 v36.69,22.94 40.5,22.94
  Top 0.762: J3.1-2 31.38,23.92
  Bottom 0.254: J3.1 33.51,24.21 33.51,24.05 J3.1-4 33.51,24.37 33.51,24.69 J3.1-3 | v36.69,22.94 v36.69,25.01
VIN  (via drill 0.33)
  Top 0.254: J2.VIN_B J2.VIN_A | C1.1 9.54,16.27 9.54,16.75 10.02,17.23 IC2.20 10.18,17.23 v14.14,17.23 | 25.73,18.18 25.73,18.66 IC1.2 | 25.73,18.18 28.27,18.18 28.75,17.7 28.75,17.55 | 29,17.04 28.72,17.04 | 27.48,15.8 27.32,15.8 23.83,15.8 23.03,16.59 C2.1 22.88,16.75 21.61,16.75 20.34,18.02 IC1.20 20.18,18.02 19.06,18.02 v17.95,16.91 | 25.73,18.18 IC1.1 | v32.24,33.1 31.61,33.1 29.86,31.36 29.86,25.16 30.18,24.85 30.18,23.45 30.5,23.13 | v39.38,21.51 38.91,21.04 38.11,21.04 D1.C | v39.07,18.81 38.59,18.34 38.59,17.55 C4.1
  Top 0.381: 28.75,17.55 28.75,17.07 27.48,15.8 | 28.72,17.04 29.86,15.89 29.86,9.29 | J2.VIN_A 41.29,10.08 | 29.86,9.29 27.86,9.29 27.32,9.83 27.32,15.8 | 29.86,9.04 29.86,9.29 | JP5.1 30.47,23.16 30.5,23.13
  Top 0.762: 30.5,23.13 30.5,18.53 29,17.04 | 41.29,10.08 40.24,9.04 29.86,9.04
  Bottom 0.254: C3.1 40.66,40.72 38.11,40.72 37.64,41.2 37.64,41.67 IC3.5 37.48,41.83 37.48,42.79 36.69,43.58 36.05,43.58 35.1,42.63 35.1,41.83 IC3.1 35.1,41.67 35.1,35.96 IC3.14 34.94,35.8 v32.24,33.1 | v14.14,17.23 17.64,17.23 v17.95,16.91 | v39.38,21.51 39.38,19.13 v39.07,18.81 36.84,16.59 36.84,15.8 37.16,15.48 37.16,13.89 37.48,13.58 37.48,8.5 38.27,7.7 39.23,7.7 41.29,9.77 J2.VIN_A

### Text on the board
Top: 2020-09-20
tPlace: pixl.mx/ / smkit17 | SmartLED / Shield / Teensy | OE | CK | A2 | A0 | B2 | R2 | B1 | R1 | RED WIRE | 4 | for | LT | A3 | A1 | A4 | G2 | G2 | G1 | V5 | 12 | 11 | 10 | 9 | 8 | 7 | 6 | 5 | 4 | 3 | 2 | 1 | 0 | 13 | 14 | 15 | 16 | 17 | 18 | 19 | 20 | 21 | 22 | 23 | 3V | AG | V+
bPlace: +5V | DAT | CLK | GND
Document: SmartLED Shield for Teensy 4 | Rev V5 | Pixelmatix 2020 CC BY-SA